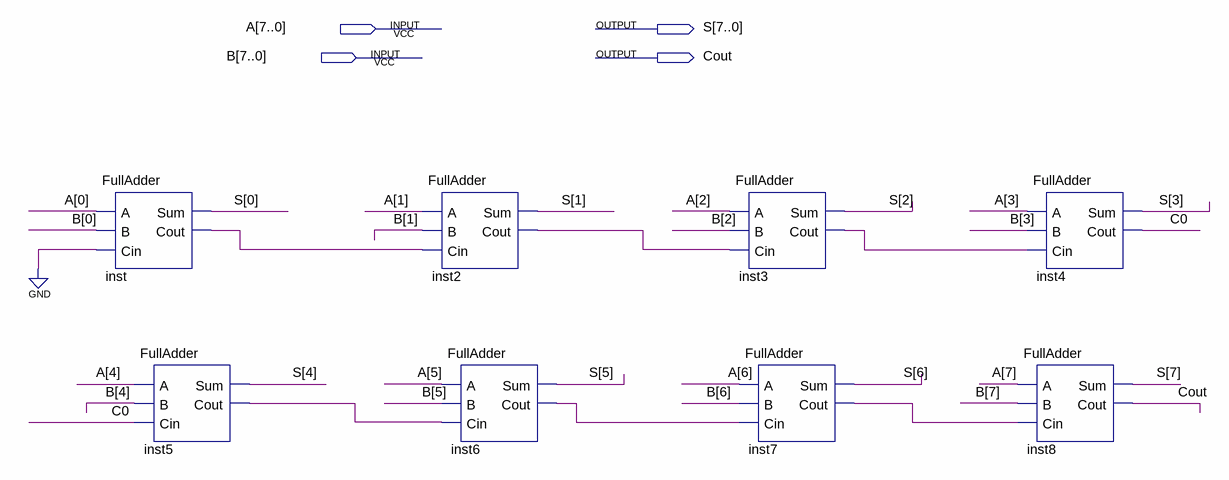
[diagram p0: schematic sheet]
// Quartus schematic test_adder.bdf as structural Verilog: 8 symbols, 4 pins
module test_adder (
  input  [7:0] A,
  input  [7:0] B,
  output [7:0] S,
  output Cout
);

  wire C0, inst2_cout, inst3_cout, inst5_cout, inst6_cout, inst7_cout, inst_cout;

  FullAdder inst (.A(A[0]), .B(B[0]), .Cin(1'b0), .Sum(S[0]), .Cout(inst_cout));
  FullAdder inst5 (.A(A[4]), .B(B[4]), .Cin(C0), .Sum(S[4]), .Cout(inst5_cout));
  FullAdder inst2 (.A(A[1]), .B(B[1]), .Cin(inst_cout), .Sum(S[1]), .Cout(inst2_cout));
  FullAdder inst6 (.A(A[5]), .B(B[5]), .Cin(inst5_cout), .Sum(S[5]), .Cout(inst6_cout));
  FullAdder inst3 (.A(A[2]), .B(B[2]), .Cin(inst2_cout), .Sum(S[2]), .Cout(inst3_cout));
  FullAdder inst7 (.A(A[6]), .B(B[6]), .Cin(inst6_cout), .Sum(S[6]), .Cout(inst7_cout));
  FullAdder inst4 (.A(A[3]), .B(B[3]), .Cin(inst3_cout), .Sum(S[3]), .Cout(C0));
  FullAdder inst8 (.A(A[7]), .B(B[7]), .Cin(inst7_cout), .Sum(S[7]), .Cout(Cout));
endmodule
